# Altium schematic sheet 08)USB HOST,USB Device,.SchDoc
size 297 x 209 mm
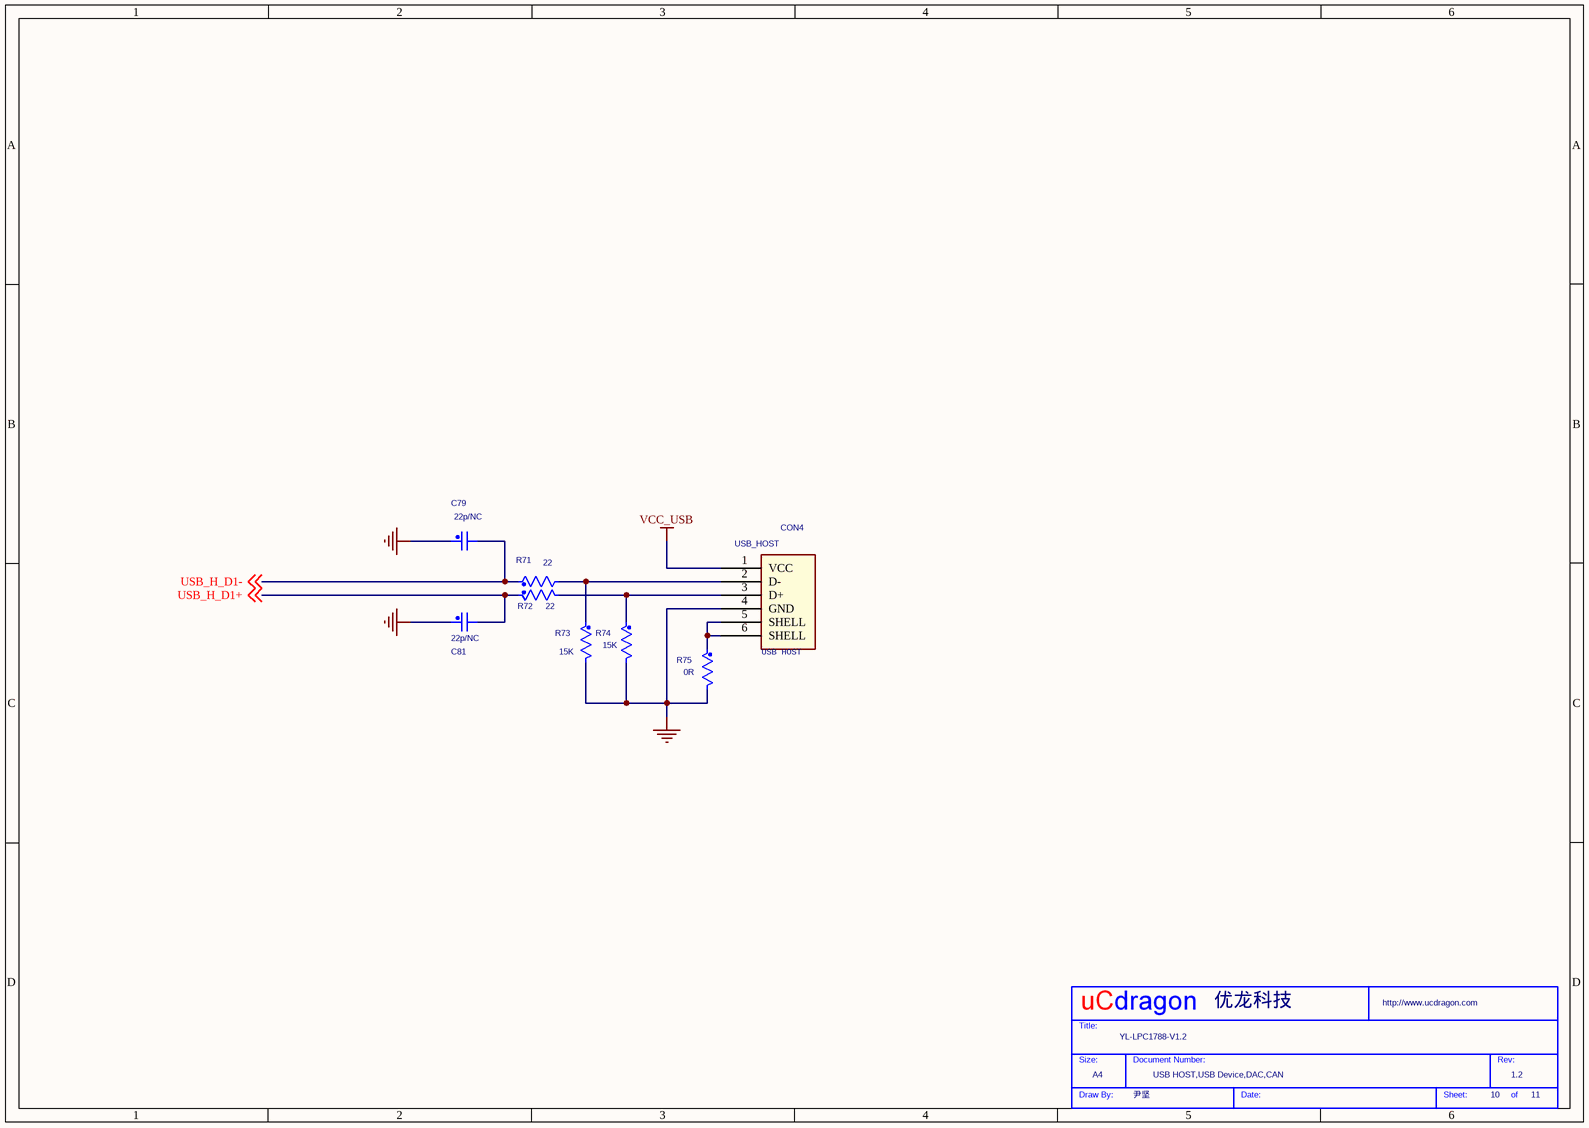
[diagram p0: 08)USB HOST,USB Device,.SchDoc]

## Parts
*  Page Count: 11  Page Number: 10  Page Size: A4  Title: YL-LPC1788-V1.2  RevCode: 1.2  Doc: USB HOST,USB Device,DAC,CAN  Drawing: 尹坚  Company: 优龙科技  (hidden comment: My Title 0)  (graphical)
C79  22p/NC  [CAP0805]
C81  22p/NC  [CAP0805]
CON4  USB_HOST  [USB-B2]
R71  22  [RES0805]
R72  22  [RES0805]
R73  15K  [RES0805]
R74  15K  [RES0805]
R75  0R  [RES0805]

## Nets
GND_POWER: C79.1 C81.1 CON4.4(GND) R73.2 R74.2 R75.2
VCC_USB: CON4.1(VCC)
USB_H_D1+: C81.2 R72.1 ; off-sheet USB_H_D1+
USB_H_D1-: C79.2 R71.1 ; off-sheet USB_H_D1-
NetCON4_2: CON4.2(D-) R71.2 R73.1
NetCON4_3: CON4.3(D+) R72.2 R74.1
NetCON4_5: CON4.5(SHELL) CON4.6(SHELL) R75.1

## Notes on the sheet
- (near CON4) USB HOST
- (in symbol My Title 0) Title:; Size:; Document Number:; Rev:; Draw By:; Date:; Sheet:; of

## Library data of the parts
C79 C81 = C_Generic: Toler.: 10%; P/N #1: C0603C104K4RAC; Voltage: 16V; Mfg #1: KEMET; Dielectric: X7R
CON4 = CON_USB_B
R71 R72 = R_Generic_Dup1: Toler.: 1%; Watts: 0.1W; P/N #1: CR10-1001F-T; Mfg #1: AVX
R73-R75 = R_Generic_Dup1: P/N #3: CR10-103J-T; Toler.: 1%; Watts: 0.1W; P/N #1: RK73H1JT1002F; Mfg #1: KOA SPEER; Mfg #3: AVX
* = My Title 0: Page Create Date: May 29, 2006; WebSite: http://www.ucdragon.com